# EAGLE schematic 393 (EAGLE 6.6.0)
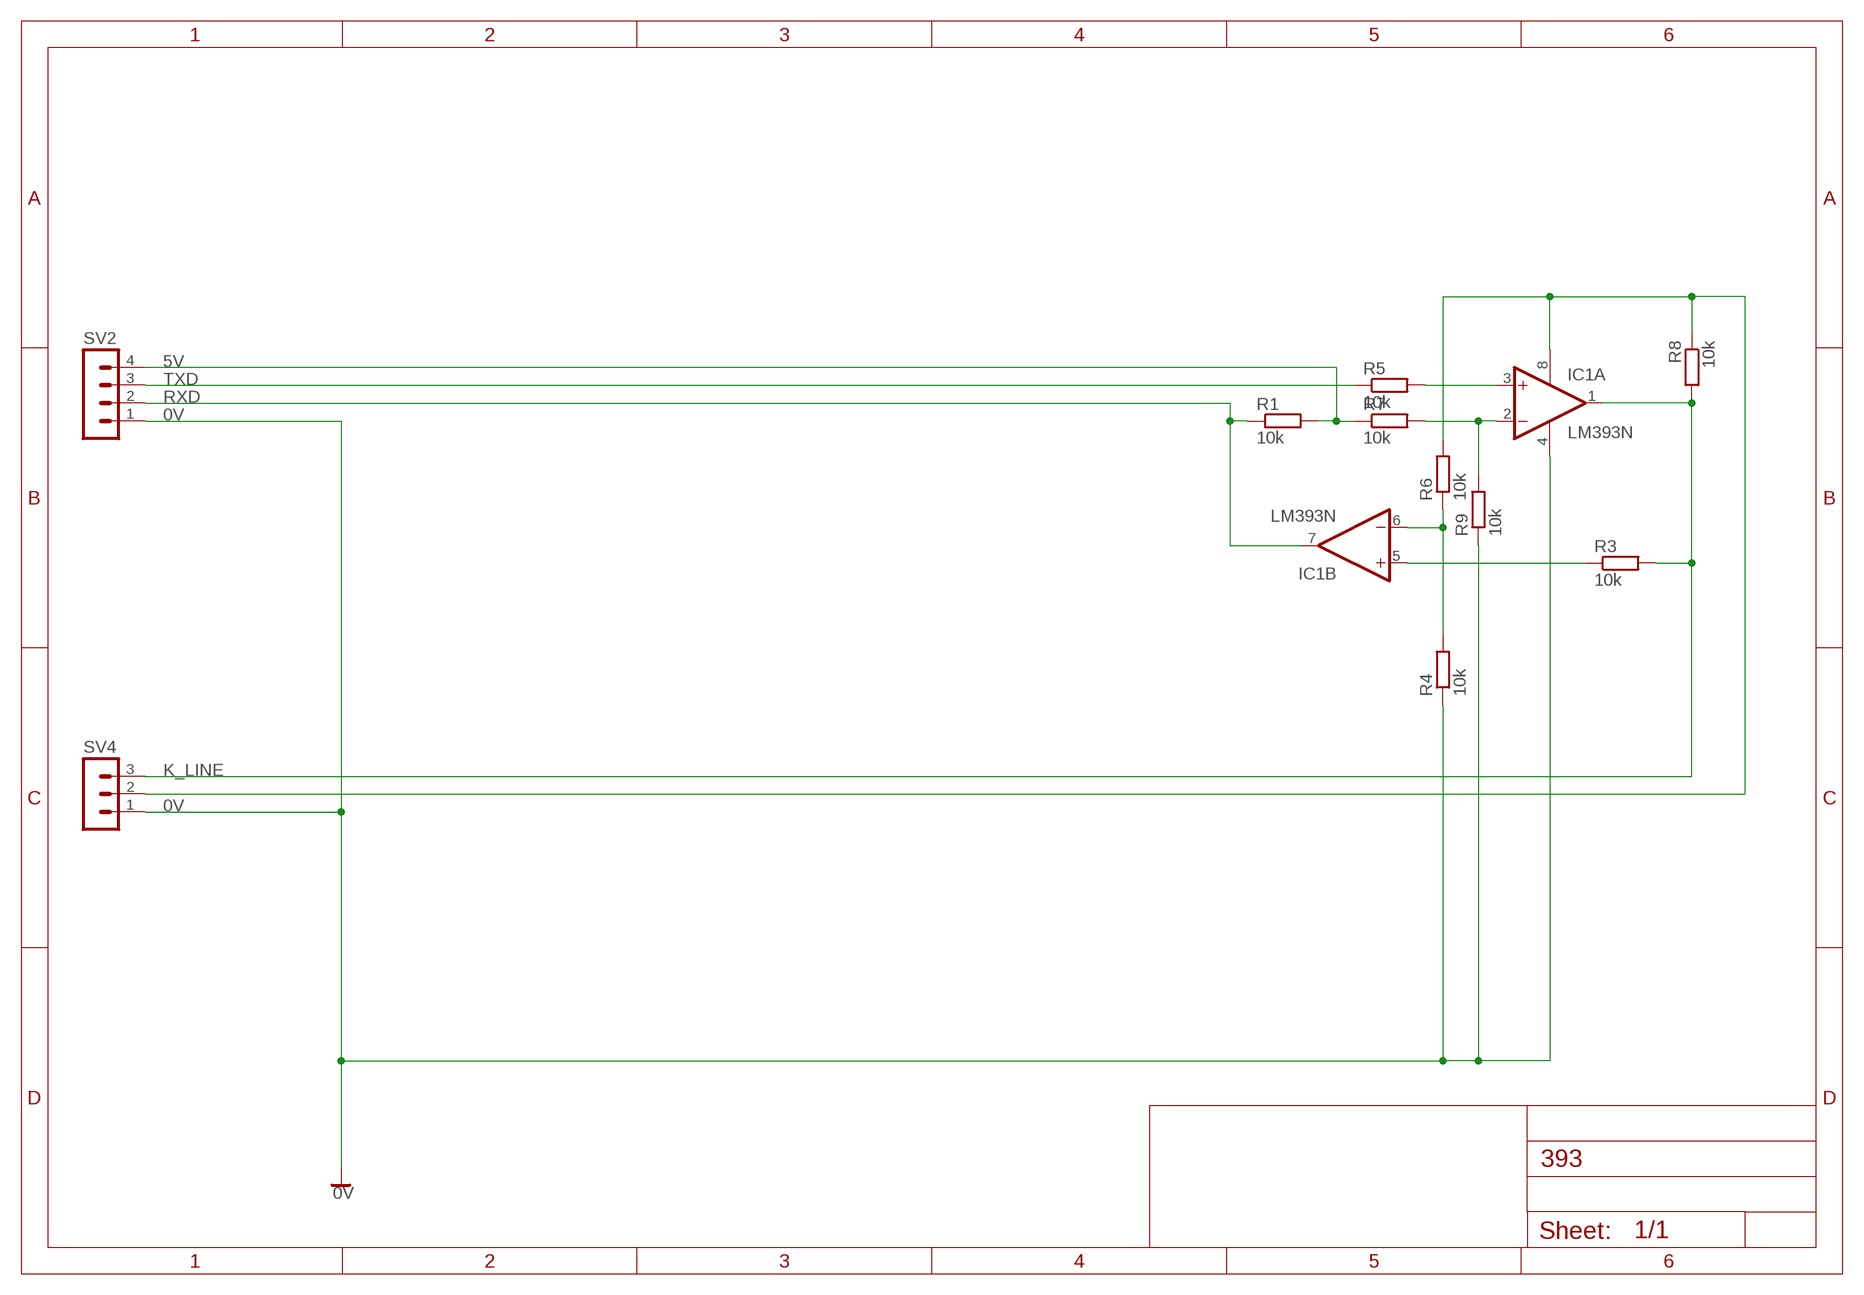
[diagram p0: schematic, sheet 1]

## Parts
IC1  LM393N  [DIL08]
R1  10k  R-EU_0207/7  [0207/7]
R3  10k  R-EU_0207/7  [0207/7]
R4  10k  R-EU_0207/7  [0207/7]
R5  10k  R-EU_0207/7  [0207/7]
R6  10k  R-EU_0207/7  [0207/7]
R7  10k  R-EU_0207/7  [0207/7]
R8  10k  R-EU_0207/7  [0207/7]
R9  10k  R-EU_0207/7  [0207/7]
SV2  MA04-1  [MA04-1]
SV4  MA03-1  [MA03-1]

## Nets
0V: IC1.4(P:V-) R4.1 R9.1 SV2.1 SV4.1
5V: R1.2 R7.1 SV2.4
12V_0,5A: IC1.8(P:V+) R6.2 R8.1 SV4.2
K_LINE: IC1.1(A:OUT) R3.2 R8.2 SV4.3
N$6: IC1.5(B:+IN) R3.1
N$7: IC1.6(B:-IN) R4.2 R6.1
N$9: IC1.3(A:+IN) R5.2
N$11: IC1.2(A:-IN) R7.2 R9.2
RXD: IC1.7(B:OUT) R1.1 SV2.2
TXD: R5.1 SV2.3

## Library data of the parts
IC1 = linear:LM393: COMPARATOR
R1 R3-R9 = rcl:R-EU_: RESISTOR, European symbol
SV2 = con-lstb:MA04-1: PIN HEADER; OC_FARNELL: unknown; OC_NEWARK: unknown
SV4 = con-lstb:MA03-1: PIN HEADER; OC_FARNELL: unknown; OC_NEWARK: unknown